# EAGLE design Micro-OLED-Breakout (EAGLE 7.6.0)
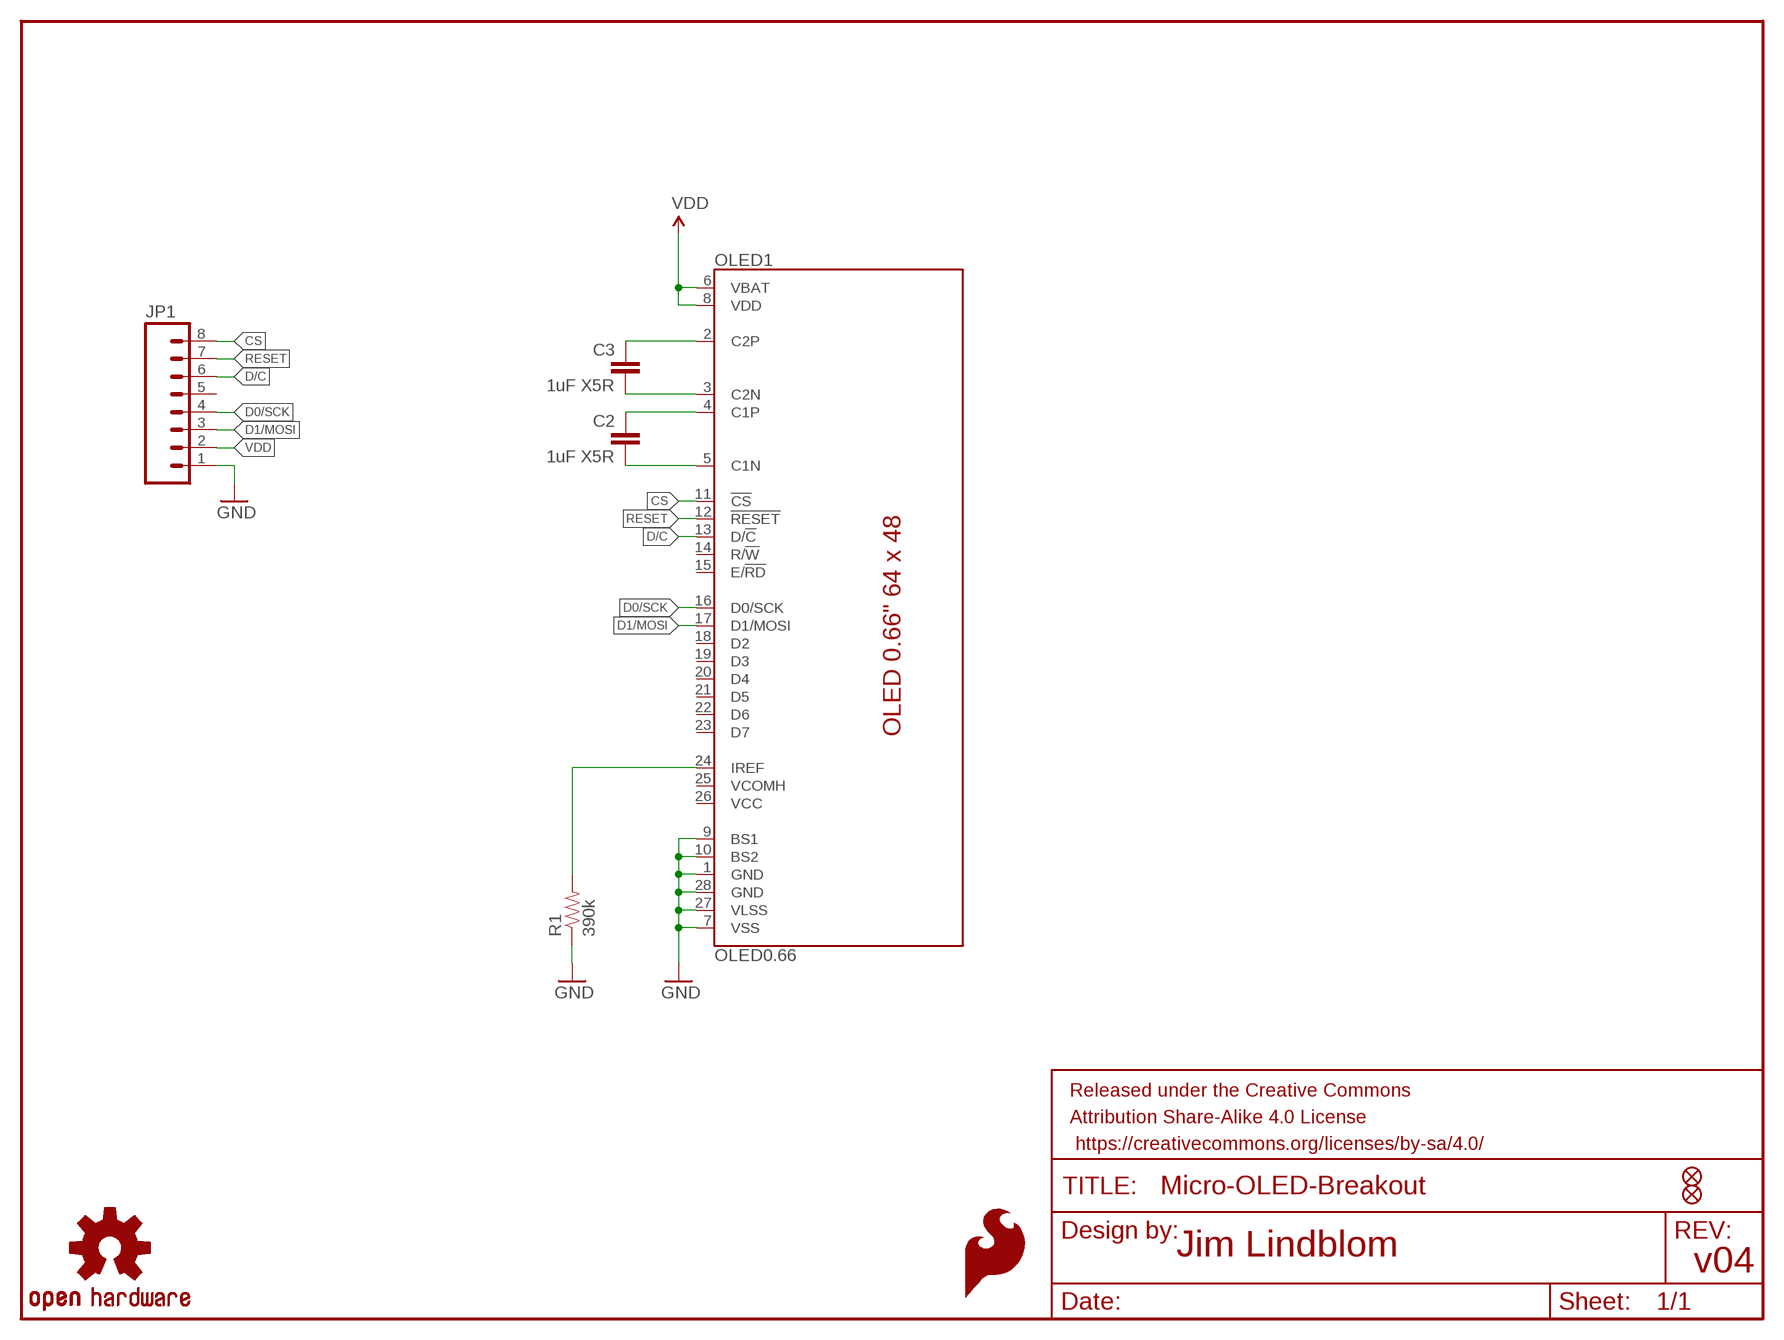
[diagram p0: schematic, sheet 1]

## Parts
C2  1uF X5R  CAP0805  [0805]
C3  1uF X5R  CAP0805  [0805]
FID1  FIDUCIAL1X2  [FIDUCIAL-1X2]
FID2  FIDUCIAL1X2  [FIDUCIAL-1X2]
FRAME1  FRAME-LETTER  [CREATIVE_COMMONS]
JP1  M08  [1X08_PIN1_NO_SILK]
LOGO3  OSHW-LOGOS  [OSHW-LOGO-S]
LOGO4  SFE_LOGO_FLAME.1_INCH  [SFE_LOGO_FLAME_.1]
OLED1  OLED0.66  [OLED-0.66-64X48]
R1  390k  RESISTOR0603-RES  [0603-RES]

## Nets
C1N: C2.2 OLED1.5(C1N)
C1P: C2.1 OLED1.4(C1P)
C2N: C3.2 OLED1.3(C2N)
C2P: C3.1 OLED1.2(C2P)
CS: JP1.8 OLED1.11(!CS!)
D0/SCK: JP1.4 OLED1.16(D0/SCK)
D1/MOSI: JP1.3 OLED1.17(D1/MOSI)
D/C: JP1.6 OLED1.13(D/!C!)
GND: JP1.1 OLED1.1(GND) OLED1.7(VSS) OLED1.9(BS1) OLED1.10(BS2) OLED1.27(VLSS) OLED1.28(GND) R1.1
IREF: OLED1.24(IREF) R1.2
RESET: JP1.7 OLED1.12(!RESET!)
VDD: JP1.2 OLED1.6(VBAT) OLED1.8(VDD)
Unconnected: JP1.5 OLED1.14(R/!W!) OLED1.15(E/!RD!) OLED1.18(D2) OLED1.19(D3) OLED1.20(D4) OLED1.21(D5) OLED1.22(D6) OLED1.23(D7) OLED1.25(VCOMH) OLED1.26(VCC)

## Notes on the sheet
- Jim Lindblom
- v04

## Library data of the parts
C2 C3 = SparkFun-Passives:CAP: Capacitor Standard 0603 ceramic capacitor, and 0.1" leaded capacitor.
FID1 FID2 = SparkFun-Aesthetics:FIDUCIAL: Fiducial Alignment Points Various fiducial points for machine vision alignment.
FRAME1 = SparkFun-Aesthetics:FRAME-LETTER: Schematic Frame Standard 8.5x11 US Letter frame
JP1 = SparkFun-Connectors:M08: Header 8 Standard 8-pin 0.1" header. Use with straight break away headers (SKU : PRT-00116), right angle break away headers (PRT-00553), swiss pins (PRT-00743), machine pins (PRT-00117), and female headers (PRT-00115).
LOGO3 = SparkFun-Aesthetics:OSHW-LOGO: Open Source Hardware Logo This logo indicates the piece of hardware it is found on incorporates a OSHW license and/or adheres to the definition of open source hardware found here: http://freedomdefined.org/OSHW
LOGO4 = SparkFun-Aesthetics:SFE_LOGO_FLAME: SFE Logo, flame only This is the SparkFun flame logo. The logo on the schematic will always be the same size; the package variant is the height of the flame. Default layer for the logo on the board is tSilk.
OLED1 = microView-temp:OLED0.66
R1 = SparkFun-Passives:RESISTOR: Resistor Basic schematic elements and footprints for 0603, 1206, and PTH resistors.

## Board
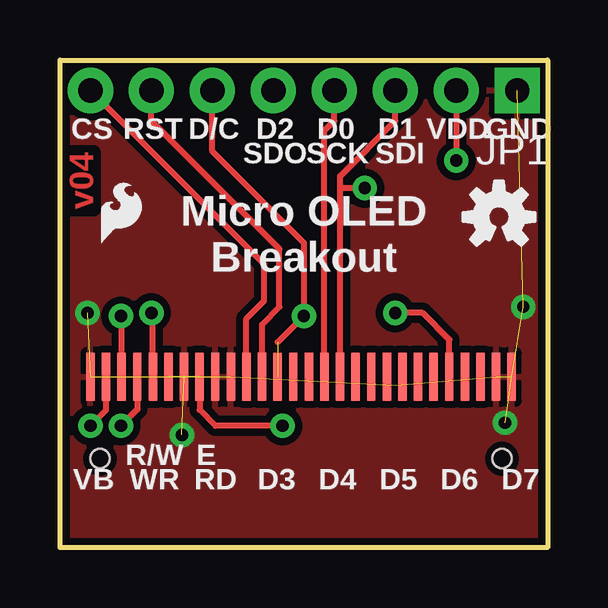
[diagram p1: board, top side]
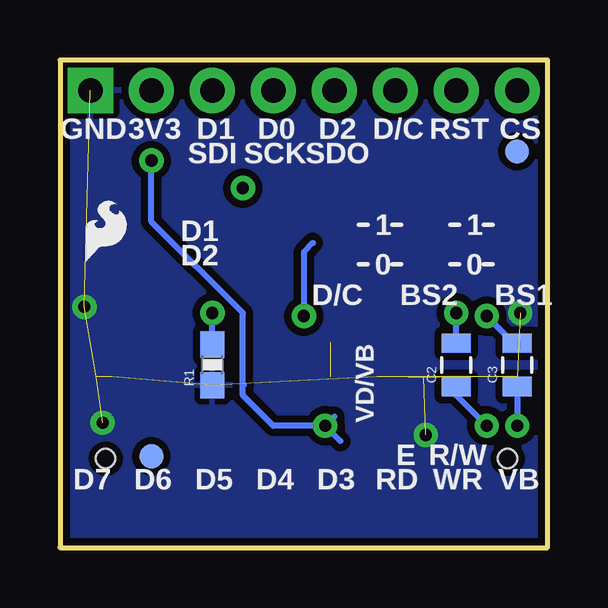
[diagram p2: board, bottom side, seen from below]

Size 20.32 x 20.32 mm. Coordinates in mm from the lower left corner, seen from the top.
Outline: 0,0 0,20.32 20.32,20.32 20.32,0 0,0
Copper layers (1*16): Top 0.035mm / dielectric 1.5mm / Bottom 0.035mm
Design rules "SparkFun-2-layer": minimum track width 7mil, minimum drill 15mil, track to track 8mil, track to pad 8mil, pad to pad 8mil, via to via 8mil, smd to smd 8mil, copper to edge 8mil, drill to drill 8mil, minimum pad ring 12mil, minimum via ring 10mil, stop-mask expansion 4mil, vias tented up to drill 20mil, thermal gap 10mil

### Footprints (pad centres in the part's own frame; a part is rotated, then mirrored left to right if it is on the bottom)
0805 = smd 0.8 x 1.2: 1 -0.9,0; 2 0.9,0
FIDUCIAL-1X2 = smd 1 x 1: 1 0,0
1X08_PIN1_NO_SILK = drill 1.016 pad 1.88 square: 1 0,0 | drill 1.016 pad 1.88: 2 2.54,0; 3 5.08,0; 4 7.62,0; 5 10.16,0; 6 12.7,0; 7 15.24,0; 8 17.78,0
OLED-0.66-64X48 = smd 0.35 x 2: 1 0,0; 2 0.65,0; 3 1.3,0; 4 1.95,0; 5 2.6,0; 6 3.25,0; 7 3.9,0; 8 4.55,0; 9 5.2,0; 10 5.85,0; 11 6.5,0; 12 7.15,0; 13 7.8,0; 14 8.45,0; 15 9.1,0; 16 9.75,0; 17 10.4,0; 18 11.05,0; 19 11.7,0; 20 12.35,0; 21 13,0; 22 13.65,0; 23 14.3,0; 24 14.95,0; 25 15.6,0; 26 16.25,0; 27 16.9,0; 28 17.55,0 | hole 0.8: 17.15,-3.4; 0.4,-3.4
0603-RES = smd 1.1 x 1: 1 -0.85,0; 2 0.85,0

### Placement (x,y rotation side)
C2  3.81,7.62 90 bottom
C3  1.27,7.62 90 bottom
FID1  16.51,3.81 0 bottom
FID2  1.27,16.51 0 bottom
FRAME1  -7.62,-8.89 0 top  (outside the outline)
JP1  19.05,19.05 180 top
LOGO2  SFE_LOGO_FLAME.1_INCH  [SFE_LOGO_FLAME_.1]  1.4,12.32 0 top
LOGO3  18.29,13.78 0 top
LOGO4  19.56,11.56 0 bottom
OLED1  1.27,7.11 0 top
R1  13.97,7.62 90 bottom

### Tracks (layer width: path | path; a pad name or v marks a point on that pad's centre or on a via)
C1N  (via drill 0.51)
  Top 0.254: OLED1.5 3.87,9.72 v3.81,9.78
  Bottom 0.254: C2.2 v3.81,9.78
C1P  (via drill 0.51)
  Top 0.254: OLED1.4 3.22,5.76 v2.54,5.08
  Bottom 0.254: C2.1 3.81,6.35 v2.54,5.08
C2N  (via drill 0.51)
  Top 0.254: OLED1.3 2.57,9.62 v2.54,9.65
  Bottom 0.254: C3.2 1.41,8.52 v2.54,9.65
C2P  (via drill 0.51)
  Top 0.254: v1.27,5.08 1.92,5.73 OLED1.2
  Bottom 0.254: C3.1 v1.27,5.08
CS
  Top 0.254: OLED1.11 7.77,9.55 8.51,10.29 8.51,11.81 JP1.8
D0/SCK
  Top 0.254: OLED1.16 11.02,17.37 11.43,17.78 JP1.4
D1/MOSI  (via drill 0.51)
  Top 0.254: OLED1.17 11.67,14.99 | 11.67,14.99 11.67,15.48 13.97,17.78 JP1.3 | v12.7,14.99 11.67,14.99
D/C  (via drill 0.51)  (1 unrouted)
  Top 0.254: 9.07,8.56 v10.16,9.65 10.16,12.7 6.35,16.51 JP1.6
  Bottom 0.254: 9.78,12.7 10.16,12.32 v10.16,9.65
GND  (via drill 0.51)  (11 unrouted)
  other vias: 5.08,4.7 18.54,5.21 1.14,9.78 19.3,10.03
  pour Top (isolate 0.305): 0,0 0,20.32 20.32,20.32 20.32,0
  pour Bottom (isolate 0.305): 0,0 0,20.32 20.32,20.32 20.32,0
IREF  (via drill 0.51)
  Top 0.254: OLED1.24 16.22,8.67 15.11,9.78 v13.97,9.78
  Bottom 0.254: R1.2 v13.97,9.78
RESET
  Top 0.254: OLED1.12 8.42,9.31 9.14,10.03 9.14,12.45 3.81,17.78 JP1.7
VDD  (via drill 0.51)  (1 unrouted)
  Top 0.254: JP1.2 v16.51,16.13 | v9.27,5.08 6.48,5.08 5.82,5.74 OLED1.8
  Bottom 0.254: 12.7,6.73 12.7,6.35 11.43,5.08 v9.27,5.08 | 12.7,6.73 12.7,9.78 16.51,13.59 v16.51,16.13 | 8.89,5.46 v9.27,5.08 | 12.66,6.77 12.7,6.73 | 8.64,4.45 v9.27,5.08

### Text on the board
Top: v04
tPlace: CS | RST | D/C | D2 | D0 | D1 | VDD | GND | SDO | SCK | SDI | Micro OLED / Breakout | R/W | E | VB | WR | RD | D3 | D4 | D5 | D6 | D7
bPlace: CS | RST | D/C | D2 | D0 | D1 | 3V3 | GND | SDO | SCK | SDI | 1 | 1 | D1 | 0 | 0 | D2 | BS1 | BS2 | D/C | VD/VB | R/W | E | VB | WR | RD | D3 | D4 | D5 | D6 | D7
tDocu: Jim Lindblom